# EAGLE design 1.54in (EAGLE 9.0.1)
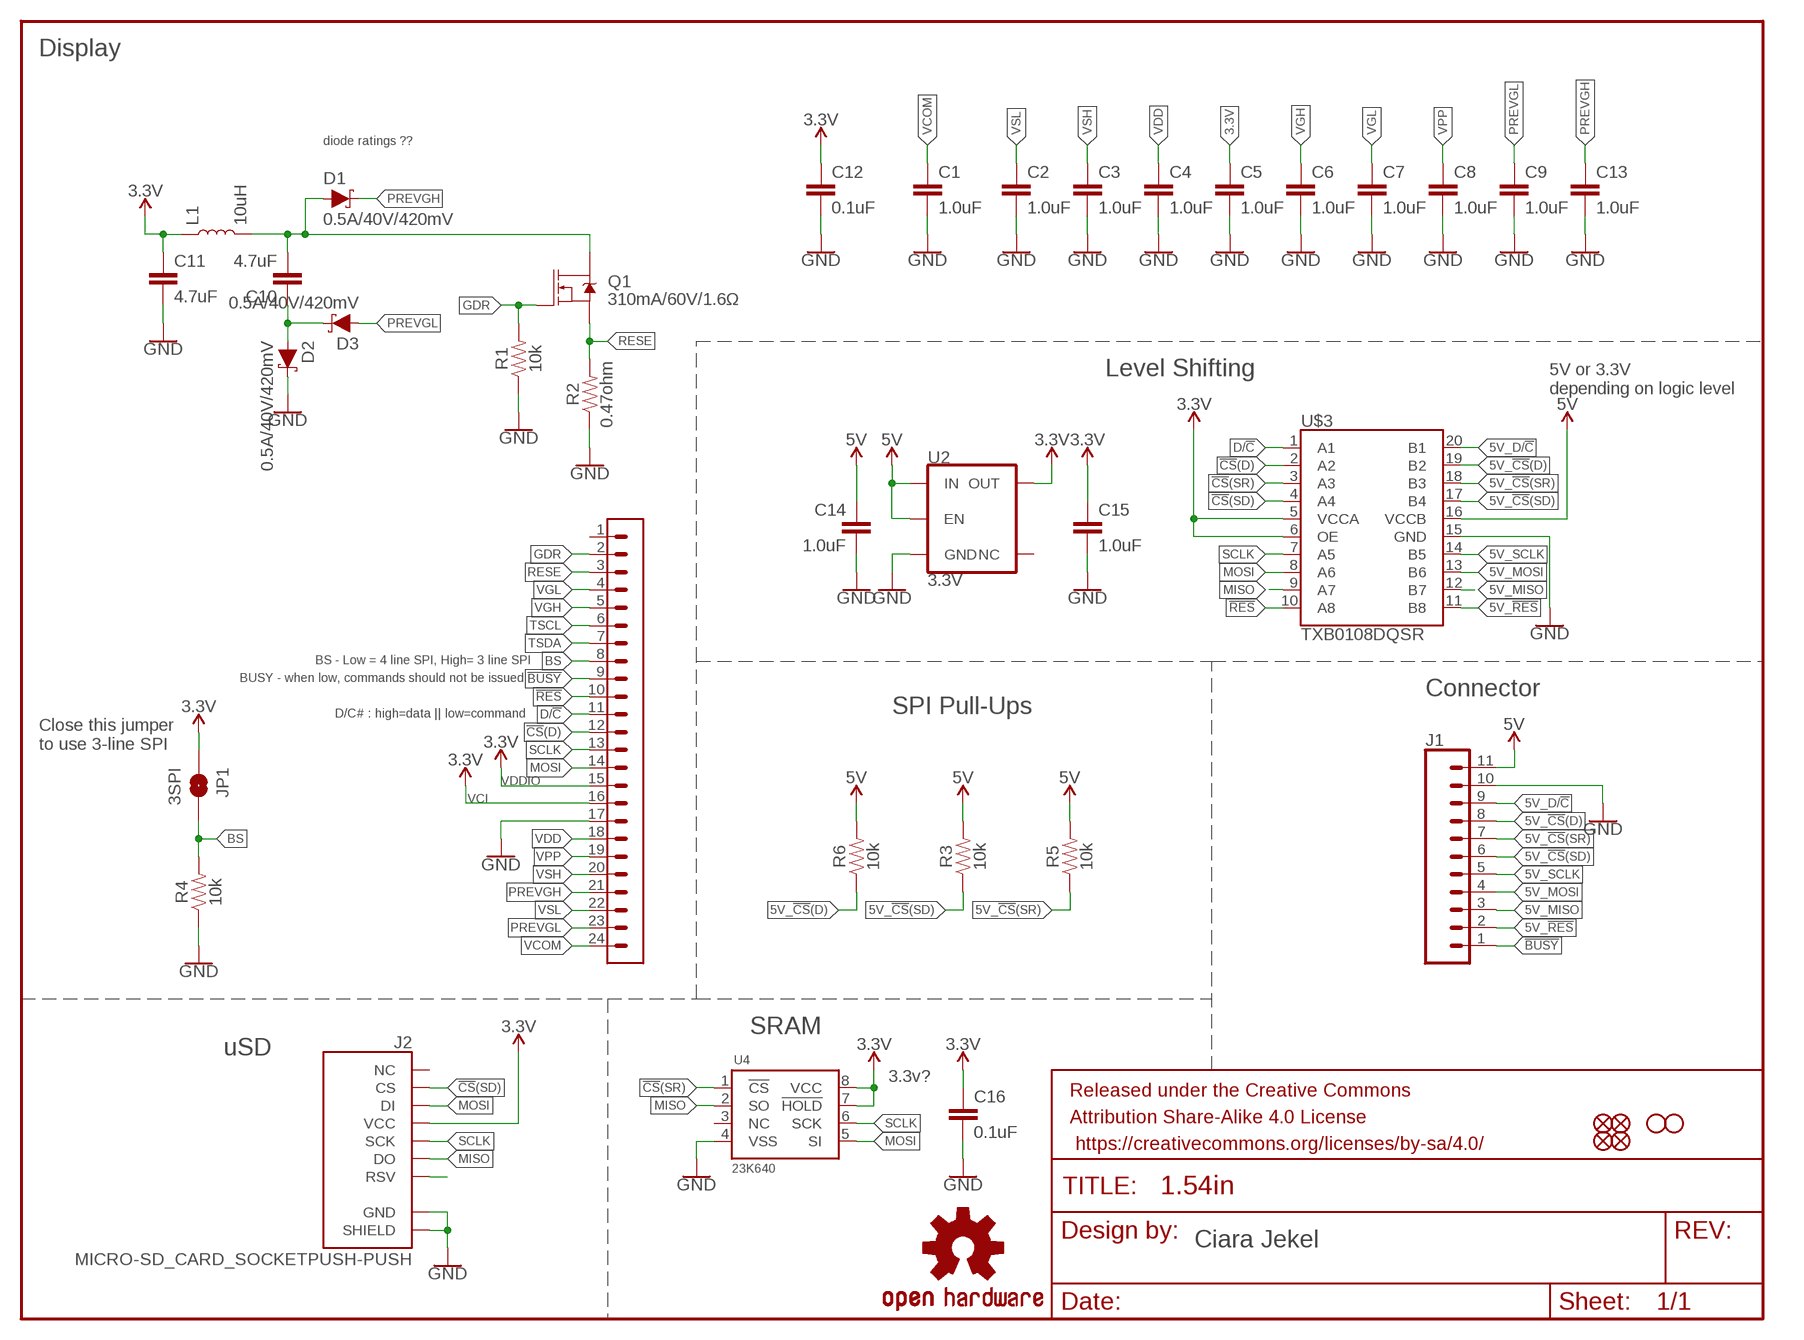
[diagram p0: schematic, sheet 1]

## Parts
C1  1.0uF  1.0UF-0603-16V-10%  [0603]
C2  1.0uF  1.0UF-0805-25V-10%  [0805]
C3  1.0uF  1.0UF-0805-25V-10%  [0805]
C4  1.0uF  1.0UF-0805-25V-10%  [0805]
C5  1.0uF  1.0UF-0805-25V-10%  [0805]
C6  1.0uF  1.0UF-0805-25V-10%  [0805]
C7  1.0uF  1.0UF-0805-25V-10%  [0805]
C8  1.0uF  1.0UF-0805-25V-10%  [0805]
C9  1.0uF  1.0UF-0805-25V-10%  [0805]
C10  4.7uF  22UF-0805-6.3V-20%  [0805]
C11  4.7uF  22UF-0805-6.3V-20%  [0805]
C12  0.1uF  0.1UF-0603-25V-(+80/-20%)  [0603]
C13  1.0uF  1.0UF-0805-25V-10%  [0805]
C14  1.0uF  1.0UF-0603-16V-10%  [0603]
C15  1.0uF  1.0UF-0603-16V-10%  [0603]
C16  0.1uF  0.1UF-0603-25V-(+80/-20%)  [0603]
D1  0.5A/40V/420mV  DIODE-SCHOTTKY-PMEG4005EJ  [SOD-323]
D2  0.5A/40V/420mV  DIODE-SCHOTTKY-PMEG4005EJ  [SOD-323]
D3  0.5A/40V/420mV  DIODE-SCHOTTKY-PMEG4005EJ  [SOD-323]
FD1  FIDUCIALUFIDUCIAL  [FIDUCIAL-MICRO]
FD2  FIDUCIALUFIDUCIAL  [FIDUCIAL-MICRO]
FD3  FIDUCIALUFIDUCIAL  [FIDUCIAL-MICRO]
FD4  FIDUCIALUFIDUCIAL  [FIDUCIAL-MICRO]
FRAME1  FRAME-LETTER  [CREATIVE_COMMONS]
H1  STAND-OFF  [STAND-OFF]
H2  STAND-OFF  [STAND-OFF]
J1  CONN_111X11_NO_SILK  [1X11_NO_SILK]
J2  MICRO-SD_CARD_SOCKETPUSH-PUSH  [MICRO-SD-SOCKET]
JP1  3SPI  JUMPER-SMT_2_NO_SILK  [SMT-JUMPER_2_NO_SILK]
L1  10uH  INDUCTOR-CDRH-10UH  [INDUCTOR_4.7UH]
LOGO1  OSHW-LOGOS  [OSHW-LOGO-S]
Q1  310mA/60V/1.6Ω  MOSFET-NCH-2N7002PW  [SOT323]
R1  10k  10KOHM-0603-1/10W-1%  [0603]
R2  0.47ohm  RESISTOR0603  [0603]
R3  10k  10KOHM-0603-1/10W-1%  [0603]
R4  10k  10KOHM-0603-1/10W-1%  [0603]
R5  10k  10KOHM-0603-1/10W-1%  [0603]
R6  10k  10KOHM-0603-1/10W-1%  [0603]
U2  3.3V  V_REG_AP2112K-3.3V  [SOT23-5]
U4  23K640  [SO08]
U$1  24_PIN_FPC_0.5MM  [24_PIN_FPC_0.5MM]
U$3  TXB0108DQSR  TXB0108  [UFDFN-20]

## Nets
3.3V: C5.1 C11.1 C12.1 C15.1 C16.1 J2.VCC JP1.1 L1.P$1 U2.5(OUT) U4.7(!HOLD) U4.8(VCC) U$1.15 U$1.16 U$3.5(VCCA) U$3.6(OE)
5V: C14.1 J1.11 R3.2 R5.2 R6.2 U2.1(IN) U2.3(EN) U$3.16(VCCB)
5V_!CS!(D): J1.8 R6.1 U$3.19(B2)
5V_!CS!(SD): J1.6 R3.1 U$3.17(B4)
5V_!CS!(SR): J1.7 R5.1 U$3.18(B3)
5V_!RES: J1.2 U$3.11(B8)
5V_D/!C: J1.9 U$3.20(B1)
5V_MISO: J1.3 U$3.12(B7)
5V_MOSI: J1.4 U$3.13(B6)
5V_SCLK: J1.5 U$3.14(B5)
!BUSY: J1.1 U$1.9
!CS!(D): U$1.12 U$3.2(A2)
!CS!(SD): J2.CS U$3.4(A4)
!CS!(SR): U4.1(!CS) U$3.3(A3)
!RES: U$1.10 U$3.10(A8)
BS: JP1.2 R4.2 U$1.8
D/!C: U$1.11 U$3.1(A1)
GDR: Q1.1(G) R1.2 U$1.2
GND: C1.2 C2.2 C3.2 C4.2 C5.2 C6.2 C7.2 C8.2 C9.2 C11.2 C12.2 C13.2 C14.2 C15.2 C16.2 D2.C J1.10 J2.CD1(SHIELD) J2.GND R1.1 R2.1 R4.1 U2.2(GND) U4.4(VSS) U$1.17 U$3.15(GND)
MISO: J2.DO U4.2(SO) U$3.9(A7)
MOSI: J2.DI U4.5(SI) U$1.14 U$3.8(A6)
N$2: C10.1 D2.A D3.C
N$5: C10.2 D1.A L1.P$2 Q1.3(D)
N$11: J2.RSV1(RSV)
PREVGH: C13.1 D1.C U$1.21
PREVGL: C9.1 D3.A U$1.23
RESE: Q1.2(S) R2.2 U$1.3
SCLK: J2.SCLK(SCK) U4.6(SCK) U$1.13 U$3.7(A5)
TSCL: U$1.6
TSDA: U$1.7
VCOM: C1.1 U$1.24
VDD: C4.1 U$1.18
VGH: C6.1 U$1.5
VGL: C7.1 U$1.4
VPP: C8.1 U$1.19
VSH: C3.1 U$1.20
VSL: C2.1 U$1.22
Unconnected: J2.RSV2(NC) U2.4(NC) U4.3(NC) U$1.1

## Notes on the sheet
- Display
- diode ratings ??
- Level Shifting
- 5V or 3.3V
  depending on logic level
- BS - Low = 4 line SPI, High= 3 line SPI
- BUSY - when low, commands should not be issued
- Connector
- D/C# : high=data || low=command | SPI Pull-Ups
- Close this jumper
  to use 3-line SPI
- VDDIO
- VCI
- SRAM
- uSD
- 3.3v?
- Ciara Jekel

## Library data of the parts
C1 C14 C15 = SparkFun-Capacitors:1.0UF: 1µF ceramic capacitors A capacitor is a passive two-terminal electrical component used to store electrical energy temporarily in an electric field.; PROD_ID: CAP-00868
C2-C9 C13 = SparkFun-Capacitors:1.0UF: 1µF ceramic capacitors A capacitor is a passive two-terminal electrical component used to store electrical energy temporarily in an electric field.; PROD_ID: CAP-08064
C10 C11 = SparkFun-Capacitors:22UF: 22µF ceramic capacitors A capacitor is a passive two-terminal electrical component used to store electrical energy temporarily in an electric field.; PROD_ID: CAP-08402; VALUE: 22uF
C12 C16 = SparkFun-Capacitors:0.1UF: 0.1µF ceramic capacitors A capacitor is a passive two-terminal electrical component used to store electrical energy temporarily in an electric field.; PROD_ID: CAP-00810
D1-D3 = SparkFun-DiscreteSemi:DIODE-SCHOTTKY: Schottky diode A Schottky diode is a semiconductor diode which has a low forward voltage drop and a very fast switching action.; PROD_ID: DIO-10955
FD1-FD4 = SparkFun-Aesthetics:FIDUCIAL: Fiducial Alignment Points Point-of-reference for pick-and-place machines and other optical instruments.
FRAME1 = SparkFun-Aesthetics:FRAME-LETTER: Schematic Frame - Letter Standard 8.5x11 US Letter frame
H1 H2 = SparkFun-Hardware:STAND-OFF: Stand Off Drill holes for mechanically mounting via screws, standoffs, etc. Note: Use the keepout ring to avoid running the screw head into surrounding components. Variant Overviews STAND-OFF - Mechanical footprint for a #4 phillips button head screw. STAND-OFF-TIGHT - Mechanical footprint for a #4 phillips button head screw, Example SparkFun Products Screw - Phillips Head (1/4", 4-40, 10 pack) <https://www.sparkfun.com/products/10453> (PRT-10453) Screw - Phillips Head (1/2", 4-40, 10 pack) <https://www.sparkfun.com/products/10452> (PRT-10452) Screw - Phillips Head (3/4", 4-40, 10 pack) <https://www.sparkfun.com/products/10451> (PRT-10451) Screw - Phillips Head (1", 4-40, 10 pack) <https://www.sparkfun.com/products/10450> (PRT-10450)
J1 = SparkFun-Connectors:CONN_11: Multi connection point. Often used as Generic Header-pin footprint for 0.1 inch spaced/style header connections On any of the 0.1 inch spaced packages, you can populate with these: Break Away Headers - Straight <https://www.sparkfun.com/products/116> (PRT-00116) Break Away Male Headers - Right Angle <https://www.sparkfun.com/products/553> (PRT-00553) Female Headers <https://www.sparkfun.com/products/115> (PRT-00115) Break Away Headers - Machine Pin <https://www.sparkfun.com/products/117> (PRT-00117) Break Away Female Headers - Swiss Machine Pin <https://www.sparkfun.com/products/743> (PRT-00743) For SCREWTERMINALS and SPRING TERMINALS visit here: Screw Terimnals on SparkFun.com <https://www.sparkfun.com/search/results?term=Screw+Terminals> (5mm/3.5mm/2.54mm spacing) This device is also useful as a general connection point to wire up your design to another part of your project. Our various solder wires solder well into these plated through hole pads. Hook-Up Wire - Assortment (Stranded, 22 AWG) <https://www.sparkfun.com/products/11375> (PRT-11375) Hook-Up Wire - Assortment (Solid Core, 22 AWG) <https://www.sparkfun.com/products/11367> (PRT-11367) View the entire wire category on our website here <https://www.sparkfun.com/categories/141>
J2 = SparkFun-Connectors:MICRO-SD_CARD_SOCKET: microSD Socket for Transflash Push-push type µSD socket. tDoc lines correctly indicate media card edge positions when inserting (unlocked, locked, depressed). NOTE: CD1 and CD2 are connected internally, and the default detect state of the socket is detect pin to ground. SparkFun Products: WAV Trigger <https://www.sparkfun.com/products/13660> CAN-Bus Shield <https://www.sparkfun.com/products/13262> SparkFun Level Shifing microSD Breakout <https://www.sparkfun.com/products/13743>; PROD_ID: CONN-07820
JP1 = SparkFun-Jumpers:JUMPER-SMT_2_NO: Normally open jumper This jumper has two pads in close proximity to each other. Apply solder to close the connection. Round pads are easier to solder for beginners, but are a lot larger. SparkFun Product that uses the round pads: SparkFun EL Sequencer <https://www.sparkfun.com/products/12781>
L1 = SparkFun-Coils:INDUCTOR: Inductors Resist changes in electrical current. Basically a coil of wire. SparkFun Products: SparkFun Load Cell Amplifier - HX711 <https://www.sparkfun.com/products/13879> IOIO-OTG - V2.2 <https://www.sparkfun.com/products/13613>; PROD_ID: NDUC-13968
LOGO1 = SparkFun-Aesthetics:OSHW-LOGO: Open-Source Hardware (OSHW) Logo This logo indicates the piece of hardware it is found on incorporates a OSHW license and/or adheres to the definition of open source hardware found here: http://freedomdefined.org/OSHW
Q1 = SparkFun-DiscreteSemi:MOSFET-NCH: N-channel MOSFETs Voltage controlled devices that allow control of high current outputs. SparkFun Products: SparkFun OpenScale <https://www.sparkfun.com/products/13261> SparkFun Digital Sandbox <https://www.sparkfun.com/products/12651> SparkFun Monster Moto Shield <https://www.sparkfun.com/products/10182> SparkFun MOSFET Power Controller <https://www.sparkfun.com/products/11214>; PROD_ID: TRANS-11151
R1 R3-R6 = SparkFun-Resistors:10KOHM: 10kΩ resistor A resistor is a passive two-terminal electrical component that implements electrical resistance as a circuit element. Resistors act to reduce current flow, and, at the same time, act to lower voltage levels within circuits. - Wikipedia; PROD_ID: RES-00824
R2 = SparkFun-Resistors:RESISTOR: Generic Resistor Package
U2 = SparkFun-IC-Power:V_REG_AP2112: AP2112 - 600mA CMOS LDO Regulator w/ Enable The AP2112 is CMOS process low dropout linear regulator with enable function, the regulator delivers a guaranteed 600mA (min.) continuous load current. Features Output Voltage Accuracy: ±1.5% Output Current: 600mA (Min.) Foldback Short Current Protection: 50mA Enable Function to Turn ON/OFF VOUT Low Dropout Voltage (3.3V): 250mV (Typ.) @IOUT=600mA Excellent Load Regulation: 0.2%/A (Typ.) Excellent Line Regulation: 0.02%/V (Typ.) Low Quiescent Current: 55μA (Typ.) Low Standby Current: 0.01μA (Typ.) Low Output Noise: 50μVRMS PSRR: 100Hz -65dB, 1kHz -65dB OTSD Protection Stable with 1.0μF Flexible Cap: Ceramic, Tantalum and Aluminum Electrolytic Operation Temperature Range: -40°C to 85°C ESD: MM 400V, HBM 4000V; PROD_ID: VREG-12457
U4 = SparkFun-IC-Memory:23K640
U$1 = ePaper:24_PIN_FPC_0.5MM
U$3 = SparkFun-IC-Comms:TXB0108: 8-Bit Bi-Directional Level Shifter 1.2V-3.6V (VCCA) to 1.65V-5.5V (VCCB) bi-directional level shifter with auto direction sensing. Max data rate - VCCA 1.2V: 20Mbps (50ns), VCCA 3.3V: 100Mbps (10ns) Digikey: 296-27217-1-ND (20-UFDFN) SparkFun Products SparkFun GPS Logger Shield <https://www.sparkfun.com/products/13750> (GPS-13750) SparkFun Block for Intel® Edison - microSD <https://www.sparkfun.com/products/13041> (DEV-13041) SparkFun Block for Intel® Edison - Dual H-Bridge <https://www.sparkfun.com/products/13043> (DEV-13043) SparkFun Block for Intel® Edison - GPIO <https://www.sparkfun.com/products/13038> (DEV-13038) SparkFun Block for Intel® Edison - Raspberry Pi B <https://www.sparkfun.com/products/13044> (DEV-13044); PROD_ID: IC-12292

## Board
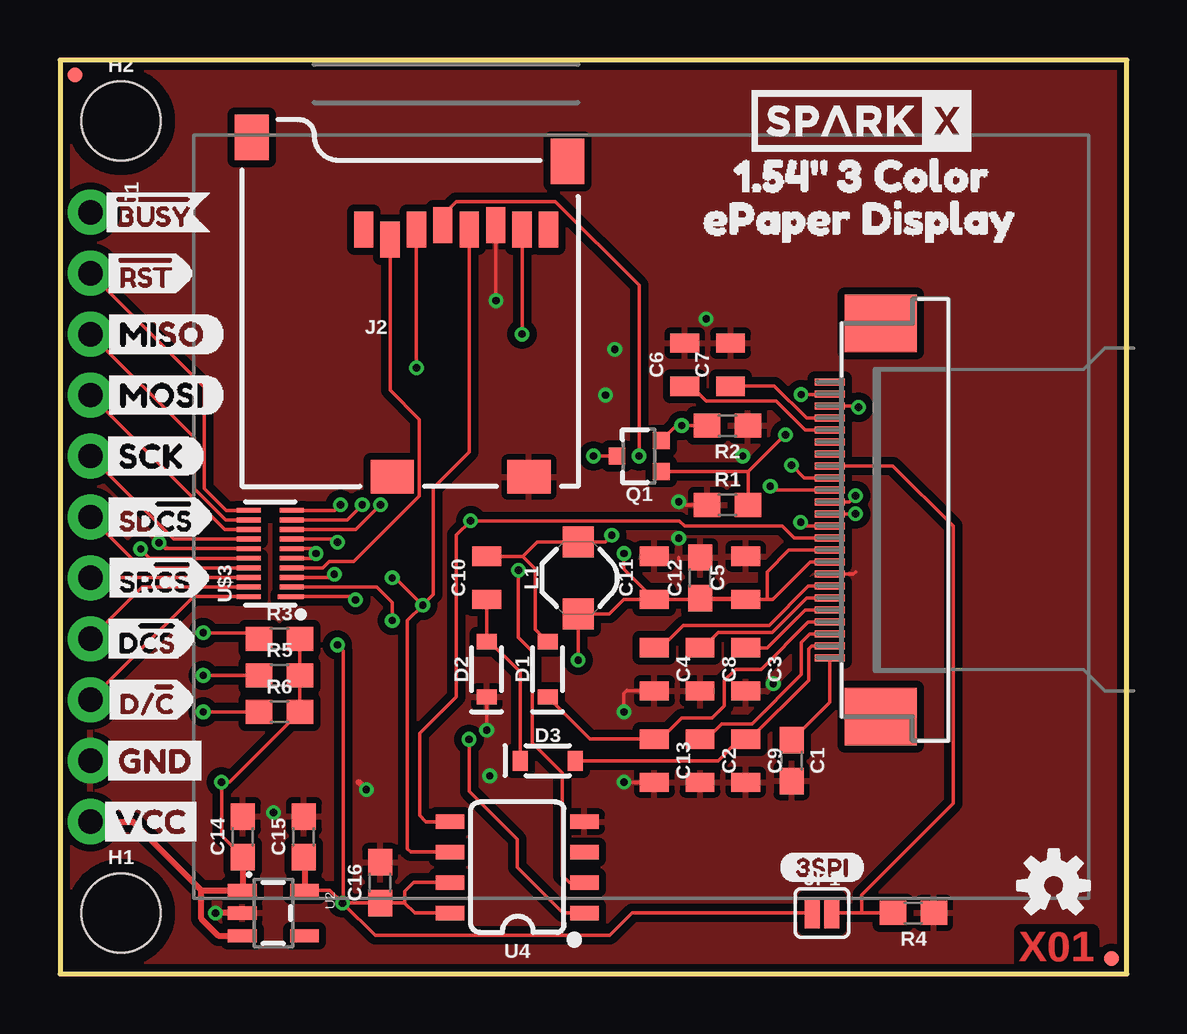
[diagram p1: board, top side]
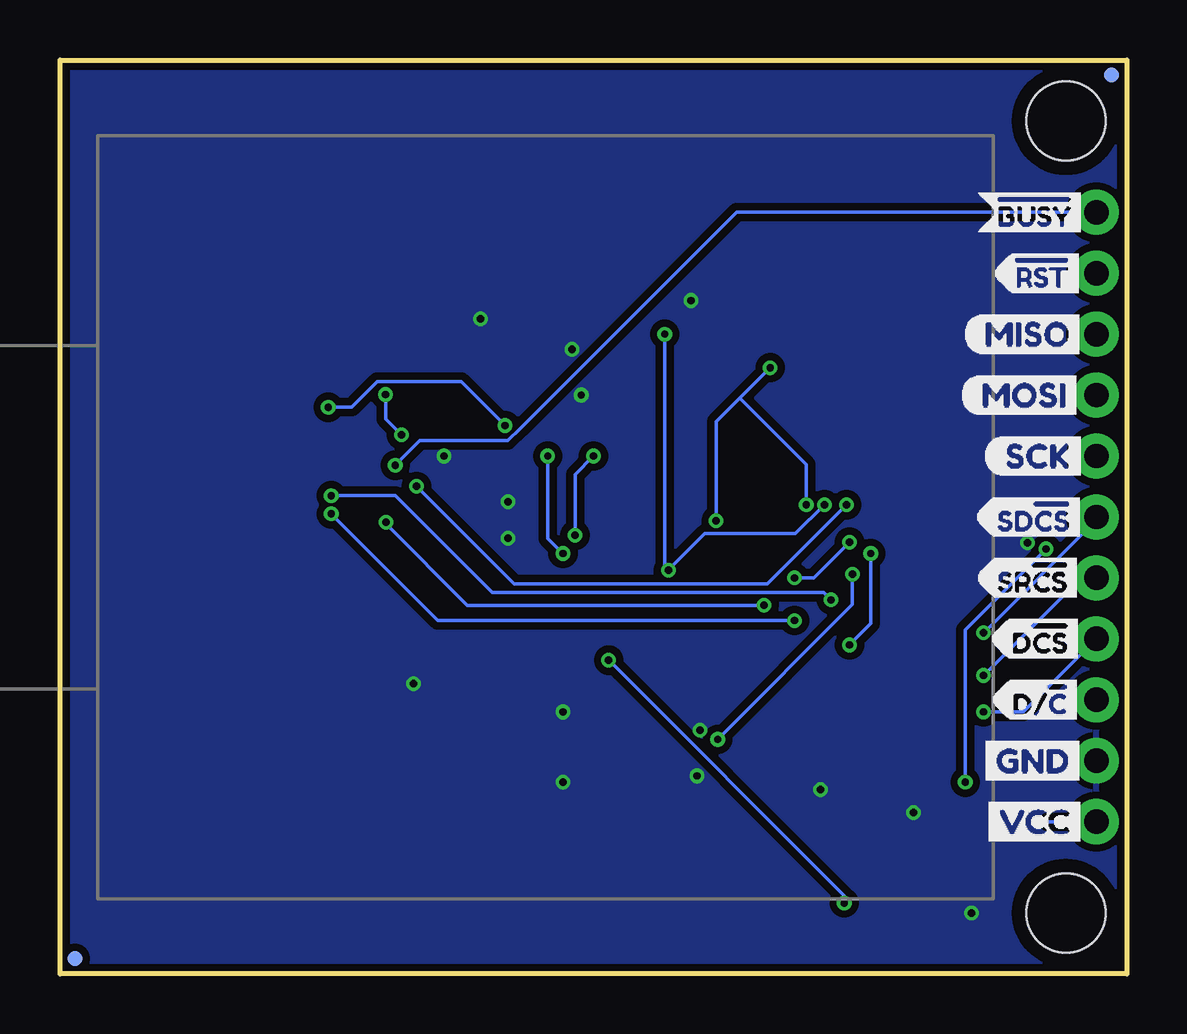
[diagram p2: board, bottom side, seen from below]

Size 44.45 x 38.1 mm. Coordinates in mm from the lower left corner, seen from the top.
Outline: 0,0 44.45,0 44.45,38.1 0,38.1 0,0
Copper layers (1*16): Top 0.035mm / dielectric 1.5mm / Bottom 0.035mm
Design rules "SparkFun-2-layer-PCBWay-LIMIT": minimum track width 6mil, minimum drill 0.3mm, track to track 6mil, track to pad 6mil, pad to pad 6mil, via to via 6mil, smd to smd 6mil, copper to edge 6mil, drill to drill 6mil, minimum pad ring 6mil, minimum via ring 6mil, stop-mask expansion 4mil, vias tented up to drill 25mil, thermal gap 10mil
tRestrict: 1 lines

### Footprints (pad centres in the part's own frame; a part is rotated, then mirrored left to right if it is on the bottom)
0603 = smd 1.1 x 1: 1 -0.85,0; 2 0.85,0
0805 = smd 0.8 x 1.2: 1 -0.9,0; 2 0.9,0
SOD-323 = smd 0.63 x 0.83: A 1.15,0; C -1.15,0
FIDUCIAL-MICRO = smd 0.635 x 0.635: 1 0,0
STAND-OFF = hole 3.302: 0,0
1X11_NO_SILK = drill 1.016 pad 1.88: 1 0,0; 2 2.54,0; 3 5.08,0; 4 7.62,0; 5 10.16,0; 6 12.7,0; 7 15.24,0; 8 17.78,0; 9 20.32,0; 10 22.86,0; 11 25.4,0
MICRO-SD-SOCKET = smd 1.8 x 1.4: CD1 -2.05,0.4; CD2 -7.75,0.4 | smd 0.8 x 1.5: CS -7.84,10.3; DI -6.74,10.7; DO -2.34,10.7; GND -3.44,10.9; RSV1 -8.94,10.7; RSV2 -1.24,10.7; SCLK -4.54,10.7; VCC -5.64,10.9 | smd 1.4 x 1.9: GND1 -13.6,14.55; GND3 -0.45,13.55
SMT-JUMPER_2_NO_SILK = smd 0.635 x 1.27: 1 -0.406,0; 2 0.406,0
INDUCTOR_4.7UH = smd 1.3 x 1.3: P$1 -1.5,0; P$2 1.5,0
SOT323 = smd 0.7 x 0.7: 1 -0.65,-0.925; 2 0.65,-0.925; 3 0,0.925
SOT23-5 = smd 0.55 x 1.2: 1 -0.95,-1.3; 2 0,-1.3; 3 0.95,-1.3; 4 0.95,1.3; 5 -0.95,1.3
SO08 = smd 0.6 x 1.2: 1 -1.905,-2.8; 2 -0.635,-2.8; 3 0.635,-2.8; 4 1.905,-2.8; 5 1.905,2.8; 6 0.635,2.8; 7 -0.635,2.8; 8 -1.905,2.8
24_PIN_FPC_0.5MM = smd 0.3 x 1.25: 1 5.75,2.225; 2 5.25,2.225; 3 4.75,2.225; 4 4.25,2.225; 5 3.75,2.225; 6 3.25,2.225; 7 2.75,2.225; 8 2.25,2.225; 9 1.75,2.225; 10 1.25,2.225; 11 0.75,2.225; 12 0.25,2.225; 13 -0.25,2.225; 14 -0.75,2.225; 15 -1.25,2.225; 16 -1.75,2.225; 17 -2.25,2.225; 18 -2.75,2.225; 19 -3.25,2.225; 20 -3.75,2.225; 21 -4.25,2.225; 22 -4.75,2.225; 23 -5.25,2.225; 24 -5.75,2.225 | smd 2.4 x 3: NC1 8.2,0.1; NC2 -8.2,0.1
UFDFN-20 = smd 0.2 x 1.1: 1 -1.8,-0.85 | smd 0.2 x 1: 2 -1.4,-0.9; 3 -1,-0.9; 4 -0.6,-0.9; 5 -0.2,-0.9; 6 0.2,-0.9; 7 0.6,-0.9; 8 1,-0.9; 9 1.4,-0.9; 10 1.8,-0.9; 11 1.8,0.9; 12 1.4,0.9; 13 1,0.9; 14 0.6,0.9; 15 0.2,0.9; 16 -0.2,0.9; 17 -0.6,0.9; 18 -1,0.9; 19 -1.4,0.9; 20 -1.8,0.9

### Placement (x,y rotation side)
C1  30.48,8.89 270 top
C2  26.67,8.89 270 top
C3  28.57,12.7 270 top
C4  24.77,12.7 270 top
C5  28.57,16.51 90 top
C6  26.04,25.4 90 top
C7  27.94,25.4 90 top
C8  26.67,12.7 270 top
C9  28.57,8.89 270 top
C10  17.78,16.51 90 top
C11  24.77,16.51 90 top
C12  26.67,16.51 90 top
C13  24.77,8.89 270 top
C14  7.62,5.71 90 top
C15  10.16,5.71 90 top
C16  13.34,3.81 90 top
D1  20.32,12.7 90 top
D2  17.78,12.7 90 top
D3  20.32,8.89 0 top
FD1  0.64,37.47 0 bottom
FD2  43.81,0.64 0 bottom
FD3  43.81,0.64 0 top
FD4  0.64,37.47 0 top
FRAME1  2.54,-10.16 0 top  (outside the outline)
H1  2.54,2.54 0 top
H2  2.54,35.56 0 top
J1  1.27,31.75 270 top
J2  21.59,20.32 0 top
JP1  31.75,2.54 0 top
L1  21.59,16.51 90 top
LOGO1  41.4,3.68 0 top
Q1  24.13,21.59 90 top
R1  27.81,19.56 0 top
R2  27.81,22.86 180 top
R3  9.14,13.97 0 top
R4  35.56,2.54 180 top
R5  9.14,12.45 0 top
R6  9.14,10.92 0 top
U2  8.89,2.54 270 top
U4  19.05,4.45 90 top
U$1  34.29,18.92 90 top
U$2  [VCC1]  1.4,6.35 0 top
U$3  8.76,17.53 90 top
U$4  [#BUSY0]  1.27,31.75 0 top
U$5  SPARKX-LOGO4  [SPARKX-MEDIUM]  33.4,35.56 0 top
U$6  [#BUSY1]  6.48,31.75 0 bottom
U$7  [D##C10]  1.4,11.43 0 top
U$8  [MISO1]  1.52,26.67 0 top
U$9  [D#CS2]  1.4,13.97 0 top
U$10  [SD#CS0]  1.4,19.05 0 top
U$11  [#RST1]  1.4,29.21 0 top
U$12  [3SPI0]  29.97,4.45 0 top
U$13  [VCC1]  6.22,6.35 0 bottom
U$14  [GND9]  1.52,8.89 0 top
U$15  [SR#CS1]  1.4,16.51 0 top
U$16  [MOSI0]  1.52,24.13 0 top
U$17  [SCK2]  1.52,21.59 0 top
U$19  [3_COLOR2]  31.24,33.27 0 top
U$20  [#RST2]  5.71,29.21 0 bottom
U$21  [EPAPER_DISPLAY5]  25.65,31.5 0 top
U$23  [1#54#1]  26.92,33.27 0 top
U$24  [MISO3]  6.86,26.67 0 bottom
U$25  [MOSI4]  6.99,24.13 0 bottom
U$26  [SCK5]  5.97,21.59 0 bottom
U$27  [SD#CS6]  6.48,19.05 0 bottom
U$28  [SR#CS7]  6.48,16.51 0 bottom
U$29  [D#CS8]  5.84,13.97 0 bottom
U$30  [D##C9]  5.84,11.43 0 bottom
U$31  [GND11]  6.35,8.89 0 bottom

### Tracks (layer width: path | path; a pad name or v marks a point on that pad's centre or on a via)
3.3V  (via drill 0.3)
  Top 0.152: C5.1 C11.1 | 28.79,15.61 C5.1 | C11.1 23.5,15.61 22.89,15.01 L1.P$1 | 21.61,14.99 L1.P$1 | U4.7 14.73,3.81 14.37,3.45 14.37,2.94 | U2.5 11.24,3.49 v11.77,2.96 | J2.VCC 15.95,31.64 16.51,32.2 20.64,32.2 24.13,28.71 v24.13,21.59 | L1.P$1 v21.59,13.08 | C12.1 28.52,15.66 C5.1 | C11.1 23.5,16.88 v23.5,17.53 | U$1.16 31.27,17.17 29.71,15.61 29.46,15.61 | C5.1 29.46,15.61 | 31.52,17.67 U$1.15 30.37,17.67 29.46,16.76 29.46,15.61 | U4.8 14.77,2.54 14.37,2.94 | 14.37,2.94 14.35,2.96 C16.1 v11.77,2.96 | JP1.1 23.85,2.54 22.91,1.6 13.13,1.6 11.81,2.92 | 11.81,2.92 v11.77,2.96 | U$3.6 10.6,17.73 10.67,17.65 v10.67,17.53 10.67,17.4 10.6,17.33 U$3.5 | v11.56,13.72 11.81,13.46 11.81,2.92
  Top 0.254: C15.1 10.19,4.83 U2.5
  Bottom 0.152: v23.5,17.53 24.13,18.16 v24.13,21.59 | v11.56,13.72 10.67,14.61 v10.67,17.53 | v11.77,2.96 11.77,3.26 v21.59,13.08
5V  (via drill 0.3)
  Top 0.152: U$3.16 3.75,17.33 v3.36,17.71 | C14.1 6.73,5.75 v6.73,8 7.07,8 R6.2 R5.2 R3.2
  Top 0.254: 5.89,3.49 U2.1 7.62,3.52 C14.1 | U2.3 6.6,1.59 5.89,2.3 5.89,3.49 | J1.11 3.03,6.35 5.89,3.49
  Bottom 0.152: 3.3,6.35 J1.11 | v3.36,17.71 6.73,14.34 v6.73,8
5V_!CS!(D)  (via drill 0.3)
  Top 0.152: J1.8 3.43,16.13 U$3.19 | R6.1 v5.97,10.92
  Bottom 0.152: v5.97,10.92 4.32,10.92 J1.8
5V_!CS!(SD)  (via drill 0.3)
  Top 0.152: J1.6 3.39,16.93 U$3.17 | R3.1 8.04,14.22 v5.97,14.22
  Bottom 0.152: v5.97,14.22 1.27,18.92 J1.6
5V_!CS!(SR)  (via drill 0.3)
  Top 0.152: J1.7 1.29,16.53 U$3.18 | R5.1 v5.97,12.45
  Bottom 0.152: v5.97,12.45 1.91,16.51 J1.7
5V_!RES
  Top 0.152: U$3.11 6.94,19.33 6.02,20.24 6.02,24.46 J1.2
5V_D/!C
  Top 0.152: J1.9 5.57,15.73 U$3.20
5V_MISO
  Top 0.152: U$3.12 6.91,18.93 5.59,20.24 5.59,22.35 J1.3
5V_MOSI
  Top 0.152: J1.4 6.87,18.53 U$3.13
5V_SCLK
  Top 0.152: J1.5 4.73,18.13 U$3.14
!BUSY  (via drill 0.3)
  Top 0.152: v30.48,21.21 31.02,20.67 U$1.9
  Bottom 0.152: J1.1 16.26,31.75 25.27,22.73 25.28,22.73 25.79,22.23 29.46,22.23 v30.48,21.21
!CS!(D)  (via drill 0.3)
  Top 0.152: v33.15,19.18 U$1.12 | U$3.2 13.21,16.13 13.84,15.49 v13.84,14.73
  Bottom 0.152: v33.15,19.18 28.7,14.73 v13.84,14.73
!CS!(SD)
  Top 0.152: J2.CS 13.75,24.34 14.97,23.12 14.97,19.93 12.24,17.19 11.21,17.19 10.94,16.93 U$3.4
!CS!(SR)  (via drill 0.3)
  Top 0.152: U4.1 20.95,2.54 19.05,4.45 19.05,5.61 17.04,7.62 v17.04,9.78 | U$3.3 11.3,16.53 v11.43,16.66
  Bottom 0.152: v11.43,16.66 11.43,15.39 v17.04,9.78
!RES  (via drill 0.3)
  Top 0.152: v29.59,20.32 29.75,20.17 U$1.10 | U$3.10 11.45,19.33 v11.68,19.56
  Bottom 0.152: v11.68,19.56 14.99,16.26 25.53,16.26 v29.59,20.32
BS
  Top 0.152: R4.2 33.4,2.54 | 33.4,2.54 JP1.2 | 32.98,21.17 U$1.8 34.71,21.17 37.21,18.67 37.21,7.11 33.4,3.3 33.4,2.54
D/!C  (via drill 0.3)
  Top 0.152: v33.15,19.94 32.88,19.67 U$1.11 | U$3.1 12.19,15.73 v12.32,15.59
  Bottom 0.152: v33.15,19.94 30.47,19.94 26.43,15.9 12.63,15.9 v12.32,15.59
GDR  (via drill 0.3)
  Top 0.152: 25.07,20.95 Q1.1 28.69,20.94 | v30.88,24.15 32.04,24.15 U$1.2 | 28.69,20.94 v30.23,22.48 | 28.69,20.94 28.69,19.58 R1.2
  Bottom 0.152: v30.23,22.48 30.88,23.14 v30.88,24.15
GND  (via drill 0.3)
  Top 0.152: J2.GND v18.15,28.08 v18.16,28.07 | C5.2 28.57,17.22 | C12.2 26.38,17.65 | 25.78,17.36 25.78,17.27 | R1.1 25.91,19.56 v25.78,19.68 | C4.2 23.63,11.8 23.62,11.81 23.5,11.68 v23.5,10.92 | U$1.17 33.06,16.67 33.15,16.76 | D2.C v17.78,10.16 | C13.2 v23.51,7.99 v23.5,8 | U$3.15 4.38,17.73 v4.13,17.97
  Top 0.254: U2.2 v6.48,2.54 | 12.45,8 v12.76,7.68
  other vias: 29.72,12.1 25.78,18.16 28.45,21.59 26.92,27.3 22.73,24.13 23.11,26.04 17.91,8.26 8.89,6.73
  pour Top (isolate 0.305): 0,38.1 44.45,38.1 44.45,0 0,0
  pour Bottom (isolate 0.305): 0,38.1 44.45,38.1 44.45,0 0,0
MISO  (via drill 0.3)
  Top 0.152: v19.25,26.67 J2.DO | v19.1,16.83 19.1,14.02 19.68,13.44 19.68,9.63 20.93,8.38 20.93,4.09 21.21,3.81 U4.2 | U$3.9 11.96,18.93 v12.59,19.56
  Bottom 0.152: 19.23,26.65 v19.25,26.67 19.25,16.98 v19.1,16.83 17.57,18.36 13.81,18.36 12.61,19.56 v12.59,19.56
MOSI  (via drill 0.3)
  Top 0.152: J2.DI 14.85,25.28 v14.86,25.27 | U$1.14 30.59,18.17 30.1,18.67 26.03,18.67 25.81,18.89 v17.11,18.89 16.51,18.29 16.51,11.56 14.99,10.03 14.99,6.6 15.24,6.35 U4.5 | U$3.8 12.32,18.53 v13.36,19.56
  Bottom 0.152: v17.11,18.89 17.11,23.02 16.13,24 | 16.13,24 v14.86,25.27 | v13.36,19.56 13.36,21.23 16.13,24
N$2
  Top 0.152: D2.A 17.78,13.97 | 17.78,13.97 C10.1 | D3.C 19.17,12.58 17.78,13.97
N$5  (via drill 0.3)
  Top 0.152: v22.23,21.59 Q1.3 | v22.99,18.29 22.71,18.01 L1.P$2 19.88,18.01 19.27,17.41 | D1.A 19.81,14.36 19.81,16.87 19.27,17.41 | 19.27,17.41 C10.2
  Bottom 0.152: v22.99,18.29 22.99,20.83 v22.23,21.59
PREVGH
  Top 0.152: D1.C 22.08,9.79 C13.1 25.03,9.79 25.91,10.67 27.18,10.67 27.69,11.18 27.69,12.23 28.15,12.7 29.21,12.7 31.18,14.67 U$1.21
PREVGL
  Top 0.152: D3.A 27.43,8.89 28.33,9.79 C9.1 28.75,9.79 31.2,12.24 31.2,13.54 31.33,13.67 U$1.23
RESE  (via drill 0.3)
  Top 0.152: R2.2 v25.91,22.86 25.68,22.86 Q1.2 | v33.27,23.62 33.22,23.67 U$1.3
  Bottom 0.152: v33.27,23.62 32.29,23.62 31.23,24.68 27.73,24.68 v25.91,22.86
SCLK  (via drill 0.3)
  Top 0.152: J2.SCLK 17.05,21.75 15.56,20.26 15.56,15.81 v15.11,15.37 | U$1.13 31.02,18.67 v30.86,18.83 | U4.6 14.61,5.08 14.48,5.21 14.48,14.73 v15.11,15.37 | 15.11,15.23 v15.11,15.37 | U$3.7 11.42,18.13 v11.56,17.99 | v13.84,16.51 13.97,16.51 v15.11,15.37
  Bottom 0.152: 30.86,18.7 v30.86,18.83 30.86,18.75 27.48,15.37 v15.11,15.37 | v11.56,17.99 13.04,16.51 v13.84,16.51
VCOM
  Top 0.152: U$1.24 32.06,11.32 C1.1
VDD
  Top 0.152: 24.98,13.6 C4.1 25.03,13.6 25.96,14.53 29.55,14.53 31.19,16.17 U$1.18
VGH
  Top 0.152: C6.1 26.3,24.5 26.93,23.87 29.85,23.87 31.05,22.67 U$1.5
VGL
  Top 0.152: C7.1 27.95,24.51 29.77,24.51 31.11,23.17 U$1.4
VPP
  Top 0.152: C8.1 26.8,13.6 | 26.8,13.6 26.89,13.6 | U$1.19 31.12,15.67 29.67,14.23 27.43,14.23 26.8,13.6
VSH
  Top 0.152: U$1.20 31.05,15.17 29.48,13.6 C3.1
VSL
  Top 0.152: C2.1 26.91,10.03 27.18,10.03 27.56,10.42 28.83,10.42 30.89,12.47 30.89,13.82 31.24,14.17 U$1.22

### Text on the board
Top: X01
tDocu: 1 | 24 | Ciara Jekel
bDocu: 1 | 24